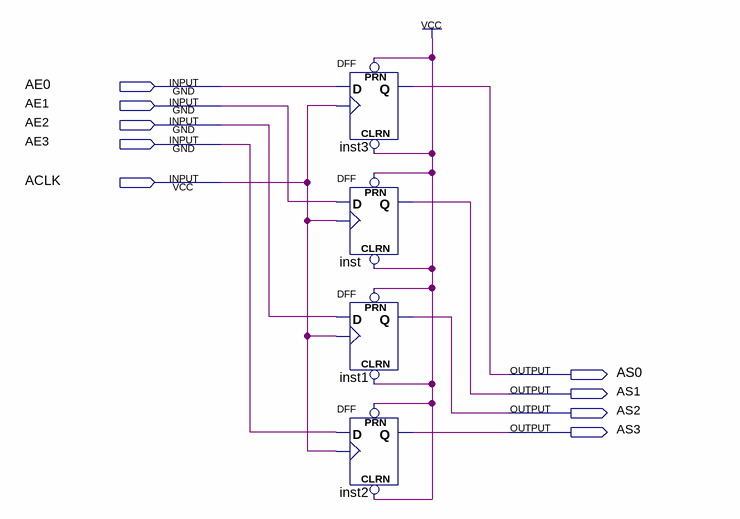
[diagram p0: schematic sheet]
// Quartus schematic guardarNUM.bdf as structural Verilog: 4 symbols, 9 pins
module guardarNUM (
  input  AE0,
  input  AE1,
  input  AE2,
  input  AE3,
  input  ACLK,
  output AS0,
  output AS1,
  output AS2,
  output AS3
);

  DFF inst3 (.CLRN(1'b1), .CLK(ACLK), .D(AE0), .PRN(1'b1), .Q(AS0));
  DFF inst (.CLRN(1'b1), .CLK(ACLK), .D(AE1), .PRN(1'b1), .Q(AS1));
  DFF inst1 (.CLRN(1'b1), .CLK(ACLK), .D(AE2), .PRN(1'b1), .Q(AS2));
  DFF inst2 (.CLRN(1'b1), .CLK(ACLK), .D(AE3), .PRN(1'b1), .Q(AS3));
endmodule
